# EAGLE design felicia (EAGLE 8.4.3)
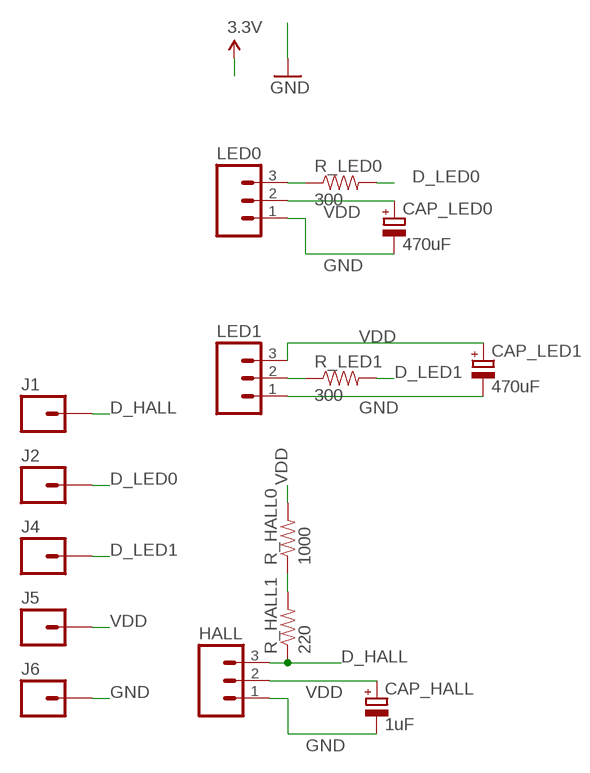
[diagram p0: schematic, sheet 1]

## Parts
CAP_HALL  1uF  CPOL-EUE5-4  [E5-4]
CAP_LED0  470uF  CPOL-EUE3.5-8  [E3,5-8]
CAP_LED1  470uF  CPOL-EUE3.5-8  [E3,5-8]
HALL  M031X03_NO_SILK  [1X03_NO_SILK]
J1  M01NOSILK-KIT  [1X01NS-KIT]
J2  M01NOSILK-KIT  [1X01NS-KIT]
J4  M01NOSILK-KIT  [1X01NS-KIT]
J5  M01NOSILK-KIT  [1X01NS-KIT]
J6  M01NOSILK-KIT  [1X01NS-KIT]
LED0  M031X03_NO_SILK  [1X03_NO_SILK]
LED1  M031X03_NO_SILK  [1X03_NO_SILK]
R_HALL0  1000  RESISTORPTH-1/4W  [AXIAL-0.4]
R_HALL1  220  RESISTORPTH-1/4W  [AXIAL-0.4]
R_LED0  300  RESISTORPTH-1/4W  [AXIAL-0.4]
R_LED1  300  RESISTORPTH-1/4W  [AXIAL-0.4]

## Nets
D_HALL: HALL.3 J1.1 R_HALL1.P$1
D_LED0: J2.1 R_LED0.P$2
D_LED1: J4.1 R_LED1.P$2
GND: CAP_HALL.- CAP_LED0.- CAP_LED1.- HALL.1 J6.1 LED0.1 LED1.1
N$1: R_HALL0.P$1 R_HALL1.P$2
N$2: LED1.2 R_LED1.P$1
N$3: LED0.3 R_LED0.P$1
VDD: CAP_HALL.+ CAP_LED0.+ CAP_LED1.+ HALL.2 J5.1 LED0.2 LED1.3 R_HALL0.P$2 ; supply symbol labelled 3.3V

## Library data of the parts
CAP_HALL CAP_LED0 CAP_LED1 = rcl:CPOL-EU: POLARIZED CAPACITOR, European symbol
HALL LED0 LED1 = SparkFun-Connectors:M03: Header 3 Standard 3-pin 0.1" header. Use with straight break away headers (SKU : PRT-00116), right angle break away headers (PRT-00553), swiss pins (PRT-00743), machine pins (PRT-00117), and female headers (PRT-00115). Molex polarized connector foot print use with SKU : PRT-08232 with associated crimp pins and housings.
J1 J2 J4-J6 = SparkFun-Connectors:M01: Header 1 Standard 1-pin 0.1" header. Use with straight break away headers (SKU : PRT-00116), right angle break away headers (PRT-00553), swiss pins (PRT-00743), machine pins (PRT-00117), and female headers (PRT-00115). SMTSO-256-ET is a "flush mount" nut for a 4-40 screw. The older package used to be too tight, and did not allow it to sit properly thru the drill hit. The latest (0.165DIA) fits nice and snug.
R_HALL0 R_HALL1 R_LED0 R_LED1 = SparkFun-Passives:RESISTOR: Resistor Basic schematic elements and footprints for 0603, 1206, and PTH resistors.

## Board
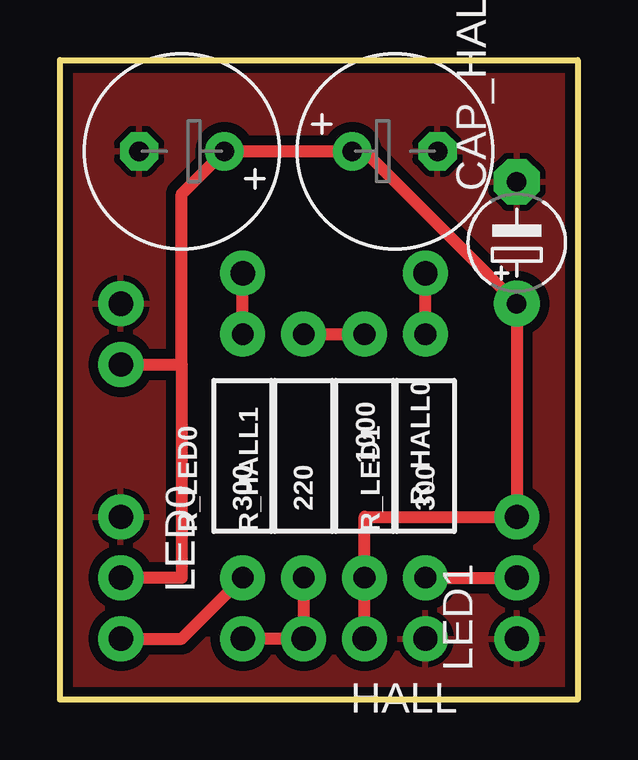
[diagram p1: board, top side]

Size 21.59 x 26.67 mm. Coordinates in mm from the lower left corner, seen from the top.
Outline: 21.59,0 0,0 0,26.67 21.59,26.67 21.59,0
Copper layers (1*16): Top 0.035559375mm / dielectric 1.6mm / Bottom 0.035559375mm
Design rules "oshpark-2layer": minimum track width 6mil, minimum drill 10mil, track to track 6mil, track to pad 6mil, pad to pad 6mil, via to via 6mil, smd to smd 6mil, copper to edge 15mil, drill to drill 6mil, minimum pad ring 5mil, minimum via ring 5mil, stop-mask expansion 2.5mil, vias tented up to drill 0mil, thermal gap 10mil

### Footprints (pad centres in the part's own frame; a part is rotated, then mirrored left to right if it is on the bottom)
E5-4 = drill 0.813 pad 1.905: + -2.54,0 | drill 0.813 pad 1.905 octagon: - 2.54,0
E3,5-8 = drill 0.813 pad 1.6: + -1.778,0 | drill 0.813 pad 1.6 octagon: - 1.778,0
1X03_NO_SILK = drill 1.016 pad 1.88: 1 0,0; 2 2.54,0; 3 5.08,0
1X01NS-KIT = drill 1.016 pad 1.88: 1 0,0
AXIAL-0.4 = drill 0.9 pad 1.88: P$1 -5.08,0; P$2 5.08,0

### Placement (x,y rotation side)
CAP_HALL  19.05,19.05 90 top
CAP_LED0  5.08,22.86 180 top
CAP_LED1  13.97,22.86 0 top
HALL  15.24,2.54 180 top
J1  7.62,2.54 0 top
J2  7.62,17.78 0 top
J4  15.24,17.78 0 top
J5  2.54,13.97 0 top
J6  2.54,16.51 0 top
LED0  2.54,7.62 270 top
LED1  19.05,2.54 90 top
R_HALL0  12.7,10.16 270 top
R_HALL1  10.16,10.16 90 top
R_LED0  7.62,10.16 90 top
R_LED1  15.24,10.16 90 top

### Tracks (layer width: path | path; a pad name or v marks a point on that pad's centre or on a via)
D_HALL
  Top 0.508: R_HALL1.P$1 HALL.3 J1.1
D_LED0
  Top 0.508: R_LED0.P$2 J2.1
D_LED1
  Top 0.508: R_LED1.P$2 J4.1
GND
  pour Top (isolate 0.406): 0,26.67 21.59,26.67 21.59,0 0,0
N$1
  Top 0.508: R_HALL1.P$2 R_HALL0.P$1
N$2
  Top 0.508: R_LED1.P$1 LED1.2
N$3
  Top 0.508: LED0.3 5.08,2.54 R_LED0.P$1
VDD
  Top 0.508: HALL.2 R_HALL0.P$2 12.7,7.62 LED1.3 CAP_HALL.+ 12.7,22.86 CAP_LED1.+ CAP_LED0.+ 5.08,21.08 5.08,13.97 | LED0.2 5.08,5.08 5.08,13.97 | J5.1 5.08,13.97